# Altium schematic sheet SchemaAction.SchDoc: Carte Actionneurs 2024-2025
size A4; DrawnBy: Oriane Doucet; DocumentNumber: 1/1; Revision: V1; SheetNumber: 1; SheetTotal: 1
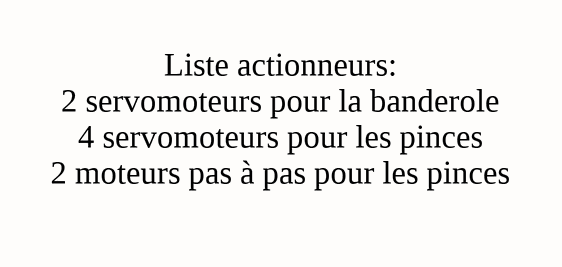
[diagram p0: SchemaAction.SchDoc]

## Notes on the sheet
- Liste actionneurs:
  2 servomoteurs pour la banderole
  4 servomoteurs pour les pinces
  2 moteurs pas à pas pour les pinces